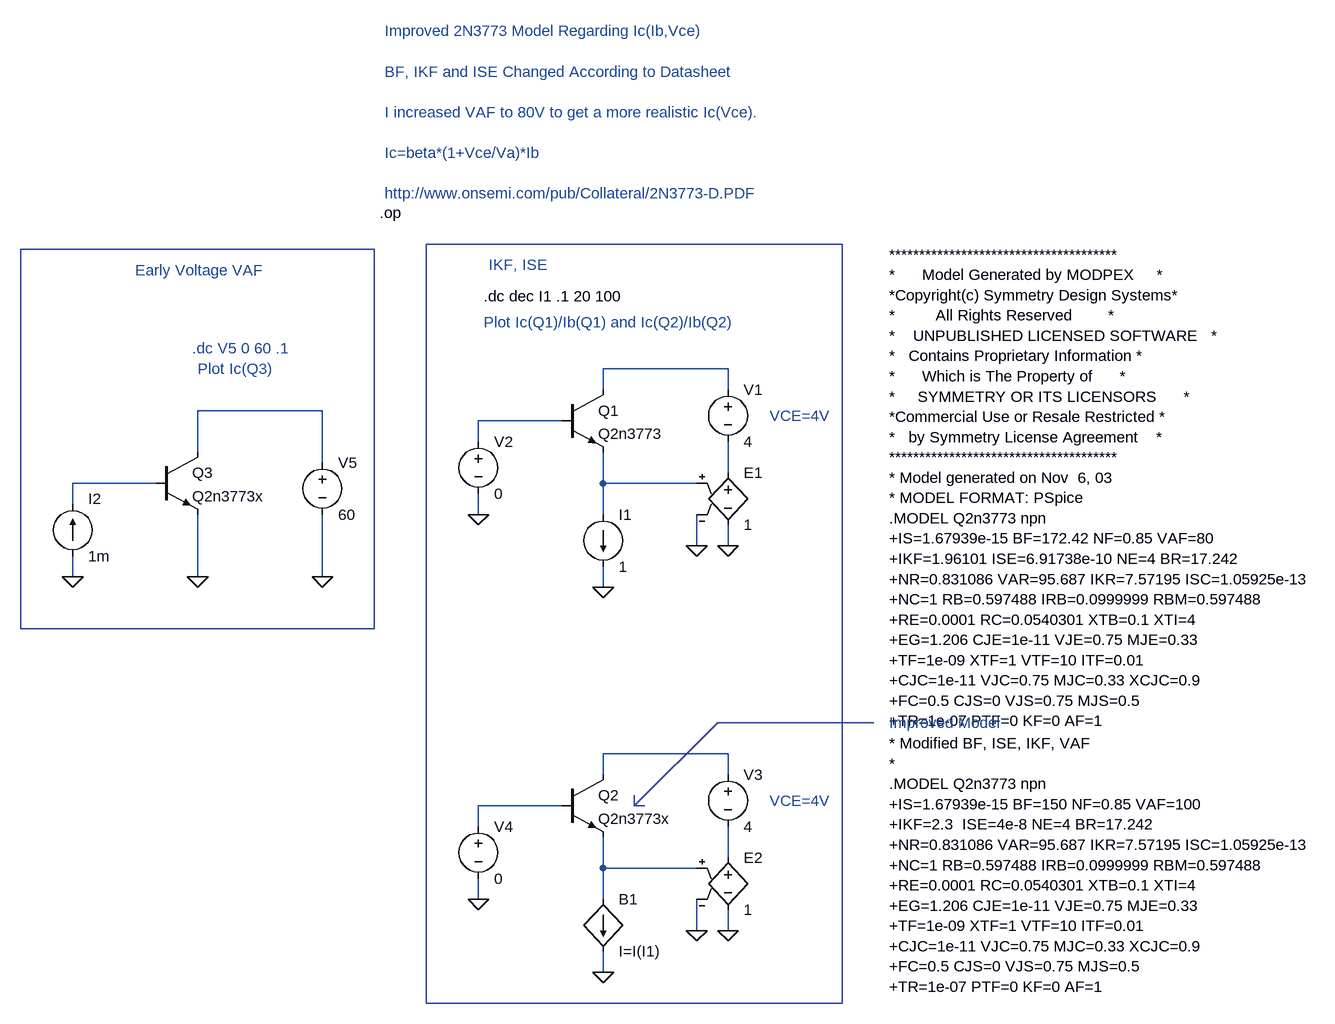
[diagram p0: schematic 2N3773_test2.asc]
2N3773_test2.asc, the LTspice schematic file:
Version 4
SHEET 1 1076 1620
WIRE -1024 432 -1024 400
WIRE -1024 544 -1024 512
WIRE -896 400 -1024 400
WIRE -832 352 -832 288
WIRE -832 544 -832 448
WIRE -640 288 -832 288
WIRE -640 368 -640 288
WIRE -640 544 -640 448
WIRE -400 336 -400 304
WIRE -400 448 -400 416
WIRE -400 928 -400 896
WIRE -400 1040 -400 1008
WIRE -272 304 -400 304
WIRE -272 896 -400 896
WIRE -208 256 -208 224
WIRE -208 400 -208 352
WIRE -208 448 -208 400
WIRE -208 560 -208 528
WIRE -208 848 -208 816
WIRE -208 992 -208 944
WIRE -208 1040 -208 992
WIRE -208 1152 -208 1120
WIRE -64 400 -208 400
WIRE -64 496 -64 448
WIRE -64 992 -208 992
WIRE -64 1088 -64 1040
WIRE -16 224 -208 224
WIRE -16 256 -16 224
WIRE -16 384 -16 336
WIRE -16 496 -16 464
WIRE -16 816 -208 816
WIRE -16 848 -16 816
WIRE -16 976 -16 928
WIRE -16 1088 -16 1056
FLAG -64 496 0
FLAG -16 496 0
FLAG -208 560 0
FLAG -400 448 0
FLAG -64 1088 0
FLAG -16 1088 0
FLAG -208 1152 0
FLAG -400 1040 0
FLAG -1024 544 0
FLAG -640 544 0
FLAG -832 544 0
SYMBOL npn -272 256 R0
SYMATTR InstName Q1
SYMATTR Value Q2n3773
SYMBOL voltage -16 240 R0
SYMATTR InstName V1
SYMATTR Value 4
SYMBOL current -208 448 R0
SYMATTR InstName I1
SYMATTR Value 1
SYMBOL e -16 368 R0
SYMATTR InstName E1
SYMATTR Value 1
SYMBOL voltage -400 320 R0
SYMATTR InstName V2
SYMATTR Value 0
SYMBOL npn -272 848 R0
SYMATTR InstName Q2
SYMATTR Value Q2n3773x
SYMBOL voltage -16 832 R0
SYMATTR InstName V3
SYMATTR Value 4
SYMBOL e -16 960 R0
SYMATTR InstName E2
SYMATTR Value 1
SYMBOL voltage -400 912 R0
SYMATTR InstName V4
SYMATTR Value 0
SYMBOL bi -208 1040 R0
SYMATTR InstName B1
SYMATTR Value I=I(I1)
SYMBOL npn -896 352 R0
SYMATTR InstName Q3
SYMATTR Value Q2n3773x
SYMBOL voltage -640 352 R0
SYMATTR InstName V5
SYMATTR Value 60
SYMBOL current -1024 512 M180
WINDOW 0 24 88 Left 0
WINDOW 3 24 0 Left 0
SYMATTR InstName I2
SYMATTR Value 1m
TEXT -392 112 Left 0 !.dc dec I1 .1 20 100
TEXT 232 800 Left 0 !* Modified BF, ISE, IKF, VAF \n*\n.MODEL Q2n3773 npn\n+IS=1.67939e-15 BF=150 NF=0.85 VAF=100\n+IKF=2.3  ISE=4e-8 NE=4 BR=17.242\n+NR=0.831086 VAR=95.687 IKR=7.57195 ISC=1.05925e-13\n+NC=1 RB=0.597488 IRB=0.0999999 RBM=0.597488\n+RE=0.0001 RC=0.0540301 XTB=0.1 XTI=4\n+EG=1.206 CJE=1e-11 VJE=0.75 MJE=0.33\n+TF=1e-09 XTF=1 VTF=10 ITF=0.01\n+CJC=1e-11 VJC=0.75 MJC=0.33 XCJC=0.9\n+FC=0.5 CJS=0 VJS=0.75 MJS=0.5\n+TR=1e-07 PTF=0 KF=0 AF=1
TEXT 232 48 Left 0 !**************************************\n*      Model Generated by MODPEX     *\n*Copyright(c) Symmetry Design Systems*\n*         All Rights Reserved        *\n*    UNPUBLISHED LICENSED SOFTWARE   *\n*   Contains Proprietary Information *\n*      Which is The Property of      *\n*     SYMMETRY OR ITS LICENSORS      *\n*Commercial Use or Resale Restricted *\n*   by Symmetry License Agreement    *\n**************************************\n* Model generated on Nov  6, 03\n* MODEL FORMAT: PSpice\n.MODEL Q2n3773 npn\n+IS=1.67939e-15 BF=172.42 NF=0.85 VAF=80\n+IKF=1.96101 ISE=6.91738e-10 NE=4 BR=17.242\n+NR=0.831086 VAR=95.687 IKR=7.57195 ISC=1.05925e-13\n+NC=1 RB=0.597488 IRB=0.0999999 RBM=0.597488\n+RE=0.0001 RC=0.0540301 XTB=0.1 XTI=4\n+EG=1.206 CJE=1e-11 VJE=0.75 MJE=0.33\n+TF=1e-09 XTF=1 VTF=10 ITF=0.01\n+CJC=1e-11 VJC=0.75 MJC=0.33 XCJC=0.9\n+FC=0.5 CJS=0 VJS=0.75 MJS=0.5\n+TR=1e-07 PTF=0 KF=0 AF=1
TEXT -544 -296 Left 0 ;Improved 2N3773 Model Regarding Ic(Ib,Vce)\n \nBF, IKF and ISE Changed According to Datasheet\n \nI increased VAF to 80V to get a more realistic Ic(Vce).\n \nIc=beta*(1+Vce/Va)*Ib\n \nhttp://www.onsemi.com/pub/Collateral/2N3773-D.PDF
TEXT 48 296 Left 0 ;VCE=4V
TEXT 48 888 Left 0 ;VCE=4V
TEXT -552 -16 Left 0 !.op
TEXT -840 192 Left 0 ;.dc V5 0 60 .1
TEXT -832 224 Left 0 ;Plot Ic(Q3)
TEXT -392 152 Left 0 ;Plot Ic(Q1)/Ib(Q1) and Ic(Q2)/Ib(Q2)
TEXT -928 72 Left 0 ;Early Voltage VAF
TEXT -384 64 Left 0 ;IKF, ISE
TEXT 232 768 Left 0 ;Improved Model
LINE Normal -32 768 -160 896
LINE Normal 208 768 -32 768
LINE Normal -144 896 -160 896
LINE Normal -144 896 -144 896
LINE Normal -144 896 -144 896
LINE Normal -160 880 -160 896
RECTANGLE Normal 160 1200 -480 32
RECTANGLE Normal -560 624 -1104 40

The netlist it stands for:
* 2N3773_test2.asc
Q1 N005 N003 N006 0 Q2n3773
V1 N005 N009 4
I1 N006 0 1
E1 N009 0 N006 0 1
V2 N003 0 0
Q2 N007 N004 N008 0 Q2n3773x
V3 N007 N010 4
E2 N010 0 N008 0 1
V4 N004 0 0
B1 N008 0 I=I(I1)
Q3 N002 N001 0 0 Q2n3773x
V5 N002 0 60
I2 0 N001 1m
.model NPN NPN
.model PNP PNP
.lib standard.bjt
.dc dec I1 .1 20 100
* Modified BF, ISE, IKF, VAF
*
.MODEL Q2n3773 npn
+IS=1.67939e-15 BF=150 NF=0.85 VAF=100
+IKF=2.3  ISE=4e-8 NE=4 BR=17.242
+NR=0.831086 VAR=95.687 IKR=7.57195 ISC=1.05925e-13
+NC=1 RB=0.597488 IRB=0.0999999 RBM=0.597488
+RE=0.0001 RC=0.0540301 XTB=0.1 XTI=4
+EG=1.206 CJE=1e-11 VJE=0.75 MJE=0.33
+TF=1e-09 XTF=1 VTF=10 ITF=0.01
+CJC=1e-11 VJC=0.75 MJC=0.33 XCJC=0.9
+FC=0.5 CJS=0 VJS=0.75 MJS=0.5
+TR=1e-07 PTF=0 KF=0 AF=1
**************************************
*      Model Generated by MODPEX     *
*Copyright(c) Symmetry Design Systems*
*         All Rights Reserved        *
*    UNPUBLISHED LICENSED SOFTWARE   *
*   Contains Proprietary Information *
*      Which is The Property of      *
*     SYMMETRY OR ITS LICENSORS      *
*Commercial Use or Resale Restricted *
*   by Symmetry License Agreement    *
**************************************
* Model generated on Nov  6, 03
* MODEL FORMAT: PSpice
.MODEL Q2n3773 npn
+IS=1.67939e-15 BF=172.42 NF=0.85 VAF=80
+IKF=1.96101 ISE=6.91738e-10 NE=4 BR=17.242
+NR=0.831086 VAR=95.687 IKR=7.57195 ISC=1.05925e-13
+NC=1 RB=0.597488 IRB=0.0999999 RBM=0.597488
+RE=0.0001 RC=0.0540301 XTB=0.1 XTI=4
+EG=1.206 CJE=1e-11 VJE=0.75 MJE=0.33
+TF=1e-09 XTF=1 VTF=10 ITF=0.01
+CJC=1e-11 VJC=0.75 MJC=0.33 XCJC=0.9
+FC=0.5 CJS=0 VJS=0.75 MJS=0.5
+TR=1e-07 PTF=0 KF=0 AF=1
* Improved 2N3773 Model Regarding Ic(Ib,Vce)
* BF, IKF and ISE Changed According to Datasheet
* I increased VAF to 80V to get a more realistic Ic(Vce).
* Ic=beta*(1+Vce/Va)*Ib
* http://www.onsemi.com/pub/Collateral/2N3773-D.PDF
* VCE=4V
* VCE=4V
.op
* .dc V5 0 60 .1
* Plot Ic(Q3)
* Plot Ic(Q1)/Ib(Q1) and Ic(Q2)/Ib(Q2)
* Early Voltage VAF
* IKF, ISE
* Improved Model
.backanno
.end